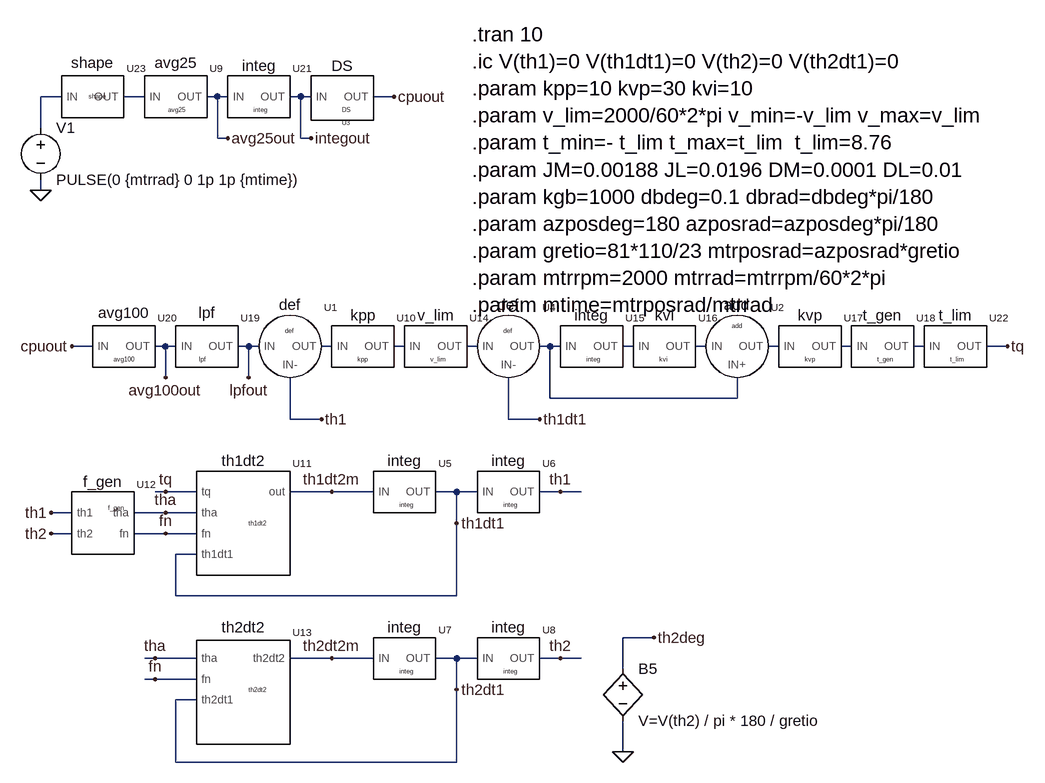
[diagram p0: schematic tama.asc]
tama.asc, the LTspice schematic file:
Version 4
SHEET 1 1588 1200
WIRE -384 -112 -416 -112
WIRE -256 -112 -288 -112
WIRE -144 -112 -160 -112
WIRE -128 -112 -144 -112
WIRE -16 -112 -32 -112
WIRE 0 -112 -16 -112
WIRE 128 -112 96 -112
WIRE -416 -64 -416 -112
WIRE -144 -48 -144 -112
WIRE -128 -48 -144 -48
WIRE -16 -48 -16 -112
WIRE 0 -48 -16 -48
WIRE -416 32 -416 16
WIRE -336 272 -368 272
WIRE -224 272 -240 272
WIRE -208 272 -224 272
WIRE -96 272 -112 272
WIRE -80 272 -96 272
WIRE 32 272 16 272
WIRE 144 272 128 272
WIRE 256 272 240 272
WIRE 368 272 352 272
WIRE 384 272 368 272
WIRE 496 272 480 272
WIRE 608 272 592 272
WIRE 720 272 704 272
WIRE 832 272 816 272
WIRE 944 272 928 272
WIRE 1072 272 1040 272
WIRE -224 320 -224 272
WIRE -96 320 -96 272
WIRE 368 352 368 272
WIRE 656 352 656 320
WIRE 656 352 368 352
WIRE -32 384 -32 320
WIRE 16 384 -32 384
WIRE 304 384 304 320
WIRE 352 384 304 384
WIRE -224 496 -240 496
WIRE -176 496 -224 496
WIRE 32 496 -32 496
WIRE 96 496 32 496
WIRE 224 496 192 496
WIRE 256 496 224 496
WIRE 384 496 352 496
WIRE 416 496 384 496
WIRE -368 528 -400 528
WIRE -224 528 -272 528
WIRE -176 528 -224 528
WIRE 224 544 224 496
WIRE -368 560 -400 560
WIRE -224 560 -272 560
WIRE -176 560 -224 560
WIRE -176 592 -208 592
WIRE -208 656 -208 592
WIRE 224 656 224 544
WIRE 224 656 -208 656
WIRE 528 720 480 720
WIRE -240 752 -256 752
WIRE -176 752 -240 752
WIRE 32 752 -32 752
WIRE 96 752 32 752
WIRE 224 752 192 752
WIRE 256 752 224 752
WIRE 384 752 352 752
WIRE 416 752 384 752
WIRE 480 768 480 720
WIRE -240 784 -256 784
WIRE -176 784 -240 784
WIRE 224 800 224 752
WIRE -176 816 -208 816
WIRE 480 896 480 848
WIRE -208 912 -208 816
WIRE 224 912 224 800
WIRE 224 912 -208 912
FLAG -416 32 0
FLAG 16 384 th1
FLAG 352 384 th1dt1
FLAG 480 896 0
FLAG 528 720 th2deg
FLAG -224 528 tha
FLAG -224 560 fn
FLAG -224 496 tq
FLAG 32 496 th1dt2m
FLAG -240 752 tha
FLAG -240 784 fn
FLAG 32 752 th2dt2m
FLAG 384 496 th1
FLAG 384 752 th2
FLAG 224 544 th1dt1
FLAG 224 800 th2dt1
FLAG -400 528 th1
FLAG -400 560 th2
FLAG 128 -112 cpuout
FLAG -368 272 cpuout
FLAG 1072 272 tq
FLAG 0 -48 integout
FLAG -224 320 avg100out
FLAG -96 320 lpfout
FLAG -128 -48 avg25out
SYMBOL voltage -416 -80 R0
SYMATTR InstName V1
SYMATTR Value PULSE(0 {mtrrad} 0 1p 1p {mtime})
SYMBOL bv 480 752 R0
SYMATTR InstName B5
SYMATTR Value V=V(th2) / pi * 180 / gretio
SYMBOL mysym/f_gen -320 544 R0
SYMATTR InstName U12
SYMBOL mysym/th1dt2 -128 512 R0
SYMATTR InstName U11
SYMBOL mysym/th2dt2 -128 768 R0
SYMATTR InstName U13
SYMBOL mysym/shape -336 -112 R0
WINDOW 38 -6 -1 Left 0
SYMATTR InstName U23
SYMBOL mysym/integ -80 -112 R0
SYMATTR InstName U21
SYMBOL mysym/DS 48 -112 R0
SYMATTR InstName U3
SYMBOL mysym/avg100 -288 272 R0
SYMATTR InstName U20
SYMBOL mysym/lpf -160 272 R0
SYMATTR InstName U19
SYMBOL add 656 272 R0
SYMATTR InstName U2
SYMBOL def -32 272 R0
SYMATTR InstName U1
SYMBOL def 304 272 R0
SYMATTR InstName U4
SYMBOL integ 144 496 R0
SYMATTR InstName U5
SYMBOL integ 304 496 R0
SYMATTR InstName U6
SYMBOL integ 144 752 R0
SYMATTR InstName U7
SYMBOL integ 304 752 R0
SYMATTR InstName U8
SYMBOL avg25 -208 -112 R0
SYMATTR InstName U9
SYMBOL kpp 80 272 R0
SYMATTR InstName U10
SYMBOL v_lim 192 272 R0
SYMATTR InstName U14
SYMBOL integ 432 272 R0
SYMATTR InstName U15
SYMBOL kvi 544 272 R0
SYMATTR InstName U16
SYMBOL kvp 768 272 R0
SYMATTR InstName U17
SYMBOL t_gen 880 272 R0
SYMATTR InstName U18
SYMBOL t_lim 992 272 R0
SYMATTR InstName U22
TEXT 248 -208 Left 3 !.tran 10\n.ic V(th1)=0 V(th1dt1)=0 V(th2)=0 V(th2dt1)=0   \n.param kpp=10 kvp=30 kvi=10\n.param v_lim=2000/60*2*pi v_min=-v_lim v_max=v_lim\n.param t_min=- t_lim t_max=t_lim  t_lim=8.76\n.param JM=0.00188 JL=0.0196 DM=0.0001 DL=0.01\n.param kgb=1000 dbdeg=0.1 dbrad=dbdeg*pi/180\n.param azposdeg=180 azposrad=azposdeg*pi/180\n.param gretio=81*110/23 mtrposrad=azposrad*gretio\n.param mtrrpm=2000 mtrrad=mtrrpm/60*2*pi\n.param mtime=mtrposrad/mtrrad

The netlist it stands for:
* tama.asc
V1 N001 0 PULSE(0 {mtrrad} 0 1p 1p {mtime})
B5 th2deg 0 V=V(th2) / pi * 180 / gretio
XU12 th1 th2 tha fn f_gen f_gen  ; pins th1 th2 tha fn
XU11 tq tha fn th1dt1 th1dt2m th1dt2 th1dt2  ; pins tq tha fn th1dt1 out
XU13 tha fn th2dt1 th2dt2m th2dt2 th2dt2  ; pins tha fn th2dt1 th2dt2
XU23 N001 N002 shape shape  ; pins IN OUT
XU21 avg25out integout integ integ  ; pins IN OUT
XU3 integout cpuout DS DS  ; pins IN OUT
XU20 cpuout avg100out avg100 avg100  ; pins IN OUT
XU19 avg100out lpfout lpf lpf  ; pins IN OUT
XU2 N008 N006 N009 add add  ; pins IN IN+ OUT
XU1 lpfout th1 N003 def def  ; pins IN IN- OUT
XU4 N005 th1dt1 N006 def def  ; pins IN IN- OUT
XU5 th1dt2m th1dt1 integ integ  ; pins IN OUT
XU6 th1dt1 th1 integ integ  ; pins IN OUT
XU7 th2dt2m th2dt1 integ integ  ; pins IN OUT
XU8 th2dt1 th2 integ integ  ; pins IN OUT
XU9 N002 avg25out avg25 avg25  ; pins IN OUT
XU10 N003 N004 kpp kpp  ; pins IN OUT
XU14 N004 N005 v_lim v_lim  ; pins IN OUT
XU15 N006 N007 integ integ  ; pins IN OUT
XU16 N007 N008 kvi kvi  ; pins IN OUT
XU17 N009 N010 kvp kvp  ; pins IN OUT
XU18 N010 N011 t_gen t_gen  ; pins IN OUT
XU22 N011 tq t_lim t_lim  ; pins IN OUT
.tran 10
.ic V(th1)=0 V(th1dt1)=0 V(th2)=0 V(th2dt1)=0
.param kpp=10 kvp=30 kvi=10
.param v_lim=2000/60*2*pi v_min=-v_lim v_max=v_lim
.param t_min=- t_lim t_max=t_lim  t_lim=8.76
.param JM=0.00188 JL=0.0196 DM=0.0001 DL=0.01
.param kgb=1000 dbdeg=0.1 dbrad=dbdeg*pi/180
.param azposdeg=180 azposrad=azposdeg*pi/180
.param gretio=81*110/23 mtrposrad=azposrad*gretio
.param mtrrpm=2000 mtrrad=mtrrpm/60*2*pi
.param mtime=mtrposrad/mtrrad
.lib mysub/f_gen.txt
.lib mysub/th1dt2.txt
.lib mysub/th2dt2.txt
.lib mysub/shape.txt
.lib mysub/integ.txt
.lib mysub/DS.txt
.lib mysub/avg100.txt
.lib mysub/lpf.txt
.lib mysub/add.txt
.lib mysub/def.txt
.lib mysub/avg25.txt
.lib mysub/kpp.txt
.lib mysub/v_lim.txt
.lib mysub/kvi.txt
.lib mysub/kvp.txt
.lib mysub/t_gen.txt
.lib mysub/t_lim.txt
.backanno
.end